# Altium schematic sheet other.SchDoc
size A4
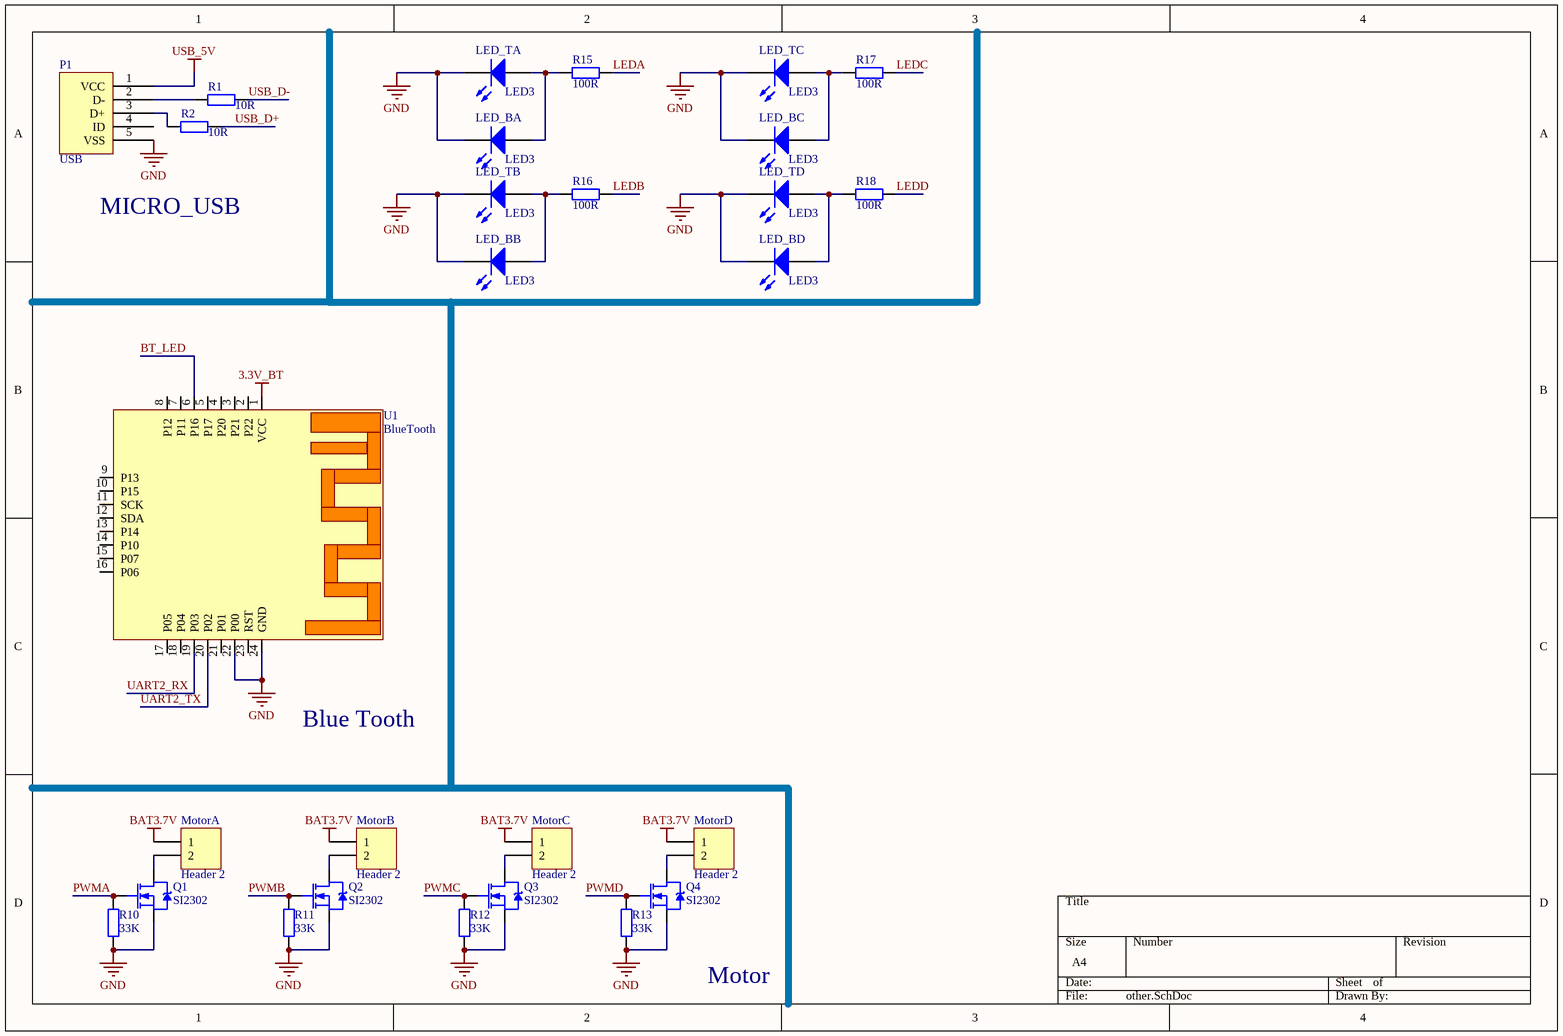
[diagram p0: other.SchDoc]

## Parts
LED_BA  LED3  [LED_0603_RED]
LED_BB  LED3  [LED_0603_RED]
LED_BC  LED3  [LED_0603_RED]
LED_BD  LED3  [LED_0603_RED]
LED_TA  LED3  [LED_0603_RED]
LED_TB  LED3  [LED_0603_RED]
LED_TC  LED3  [LED_0603_RED]
LED_TD  LED3  [LED_0603_RED]
MotorA  Header 2  [HDR2 1.25mm]
MotorB  Header 2  [HDR2 1.25mm]
MotorC  Header 2  [HDR2 1.25mm]
MotorD  Header 2  [HDR2 1.25mm]
P1  USB  [USB_MICRO_M]
Q1  SI2302  [SI2302]
Q2  SI2302  [SI2302]
Q3  SI2302  [SI2302]
Q4  SI2302  [SI2302]
R1  value 10R  [R-0603]  (hidden comment: Res2)
R2  value 10R  [R-0603]  (hidden comment: Res2)
R10  value 33K  [R-0603]  (hidden comment: Res2)
R11  value 33K  [R-0603]  (hidden comment: Res2)
R12  value 33K  [R-0603]  (hidden comment: Res2)
R13  value 33K  [R-0603]  (hidden comment: Res2)
R15  value 100R  [R-0603]  (hidden comment: Res2)
R16  value 100R  [R-0603]  (hidden comment: Res2)
R17  value 100R  [R-0603]  (hidden comment: Res2)
R18  value 100R  [R-0603]  (hidden comment: Res2)
U1  BlueTooth  [BLE_CC2541]

## Nets
3.3V_BT: U1.1(VCC)
BAT3.7V: MotorA.1 MotorB.1 MotorC.1 MotorD.1
GND: LED_BA.2(K) LED_BB.2(K) LED_BC.2(K) LED_BD.2(K) LED_TA.2(K) LED_TB.2(K) LED_TC.2(K) LED_TD.2(K) P1.5(VSS) Q1.2(S) Q2.2(S) Q3.2(S) Q4.2(S) R10.1 R11.1 R12.1 R13.1 U1.22(P00) U1.24(GND)
USB_5V: P1.1(VCC)
BT_LED: U1.6(P16)
LEDA: R15.2
LEDB: R16.2
LEDC: R17.2
LEDD: R18.2
PWMA: Q1.1(G) R10.2
PWMB: Q2.1(G) R11.2
PWMC: Q3.1(G) R12.2
PWMD: Q4.1(G) R13.2
UART2_RX: U1.19(P03)
UART2_TX: U1.20(P02)
USB_D+: R2.2
USB_D-: R1.2
NetLED_BA_1: LED_BA.1(A) LED_TA.1(A) R15.1
NetLED_BB_1: LED_BB.1(A) LED_TB.1(A) R16.1
NetLED_BC_1: LED_BC.1(A) LED_TC.1(A) R17.1
NetLED_BD_1: LED_BD.1(A) LED_TD.1(A) R18.1
NetMotorA_2: MotorA.2 Q1.3(D)
NetMotorB_2: MotorB.2 Q2.3(D)
NetMotorC_2: MotorC.2 Q3.3(D)
NetMotorD_2: MotorD.2 Q4.3(D)
NetP1_2: P1.2(D-) R1.1
NetP1_3: P1.3(D+) R2.1

Not connected (* = marked no-connect by the designer): P1 4(ID); U1 2(P22) 3(P21) 4(P20) 5(P17) 7(P11) 8(P12) 9(P13) 10(P15) 11(SCK) 12(SDA) 13(P14) 14(P10) 15(P07) 16(P06) 17(P05) 18(P04) 21(P01) 23(RST)

## Notes on the sheet
- MICRO_USB
- Blue Tooth
- Motor

## Library data of the parts
LED_BA LED_BB LED_BC LED_BD LED_TA LED_TB LED_TC LED_TD = LED3: Typical BLUE SiC LED; Published: 8-Jun-2000; LatestRevisionDate: 17-Dec-2003; LatestRevisionNote: PCB Footprint replaced.; DatasheetVersion: 16-Apr-2002; PackageVersion: 16-Apr-2002; PackageReference: 3.5X2.8X1.9; Publisher: Altium Limited; PackageDescription: SM LED; 2 C-Bend Leads; Body 3.5 x 2.8 x 1.9 mm, inc leads (LxWxH typ)
MotorA MotorB MotorC MotorD = Header 2: Header, 2-Pin; LatestRevisionDate: 17-Jul-2002; LatestRevisionNote: Re-released for DXP Platform.; Publisher: Altium Limited
R1 R2 R10-R13 R15-R18 = Res2: Resistor; Published: 8-Jun-2000; LatestRevisionDate: 17-Jul-2002; LatestRevisionNote: Re-released for DXP Platform.; PackageReference: AXIAL-0.4; Publisher: Altium Limited; PackageDescription: Axial Device, Thru-Hole; 2 Leads; 0.4 in Pin Spacing
U1 = CC2541-MOD